# Altium project SKI_Induction.PrjPCB
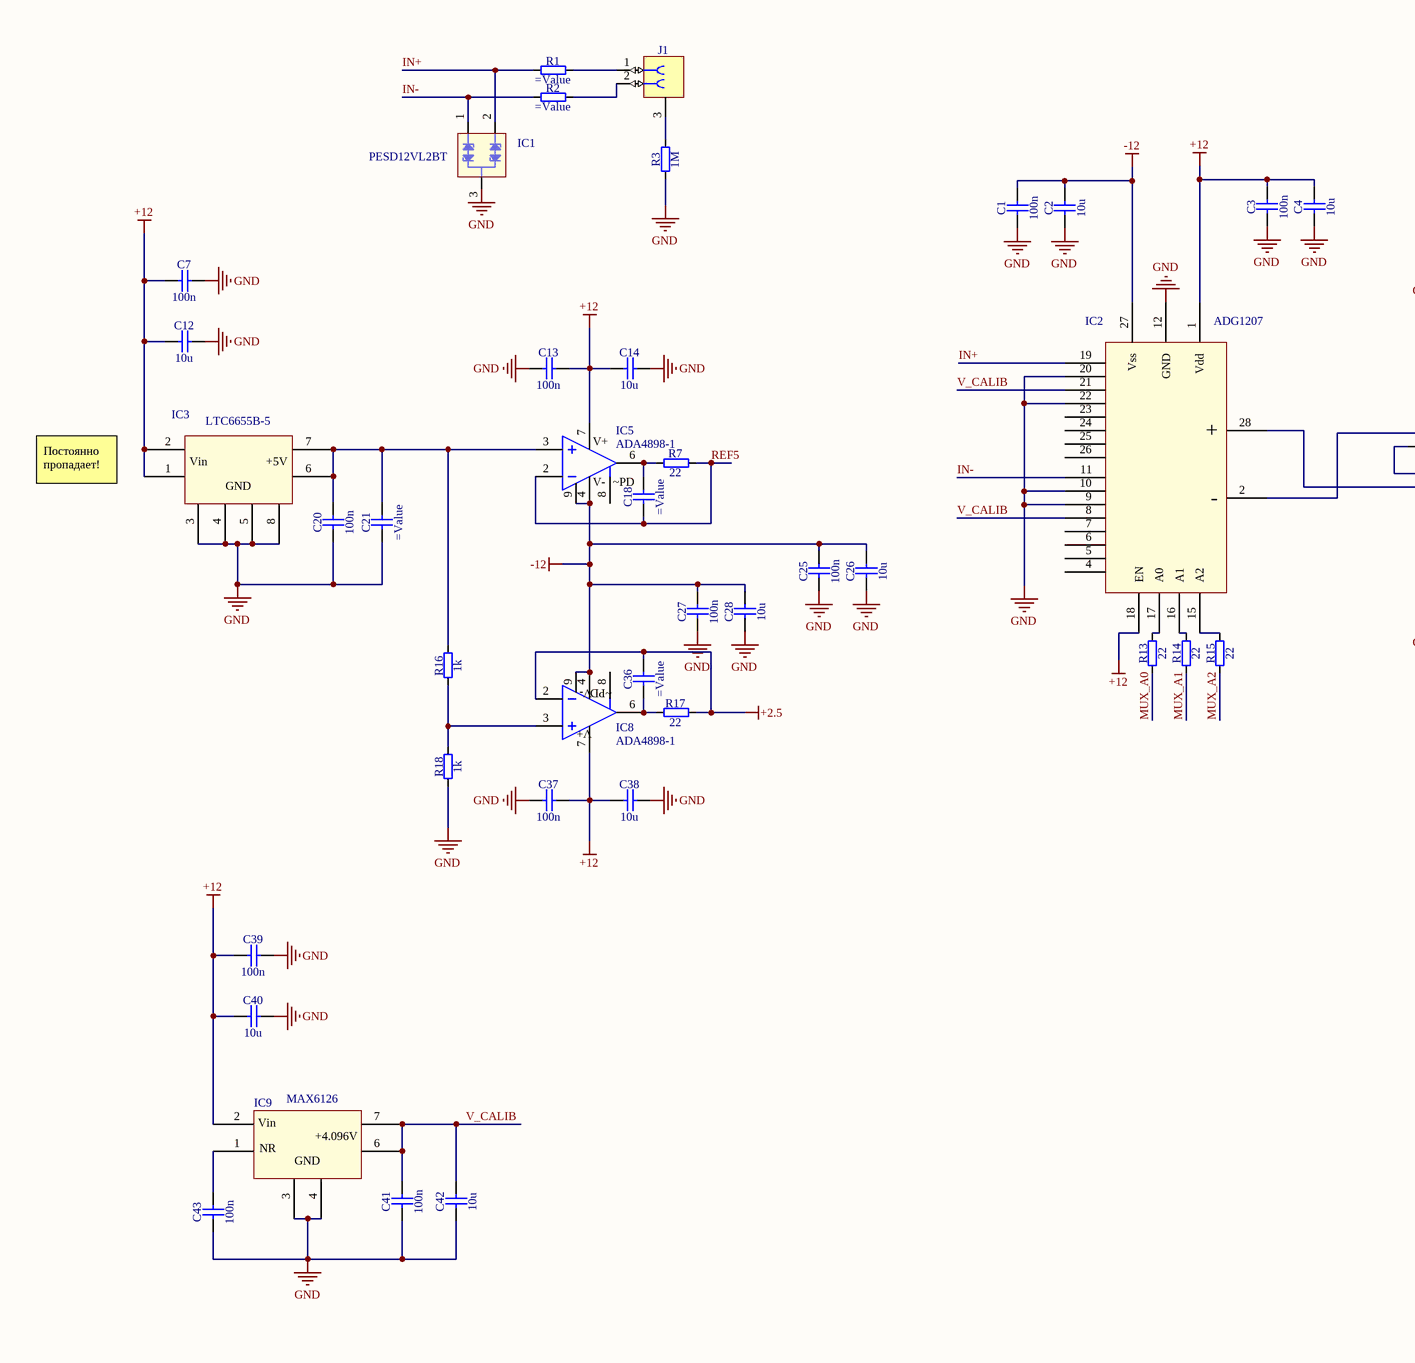
[diagram p0: Inductive_measurement.SchDoc, left]
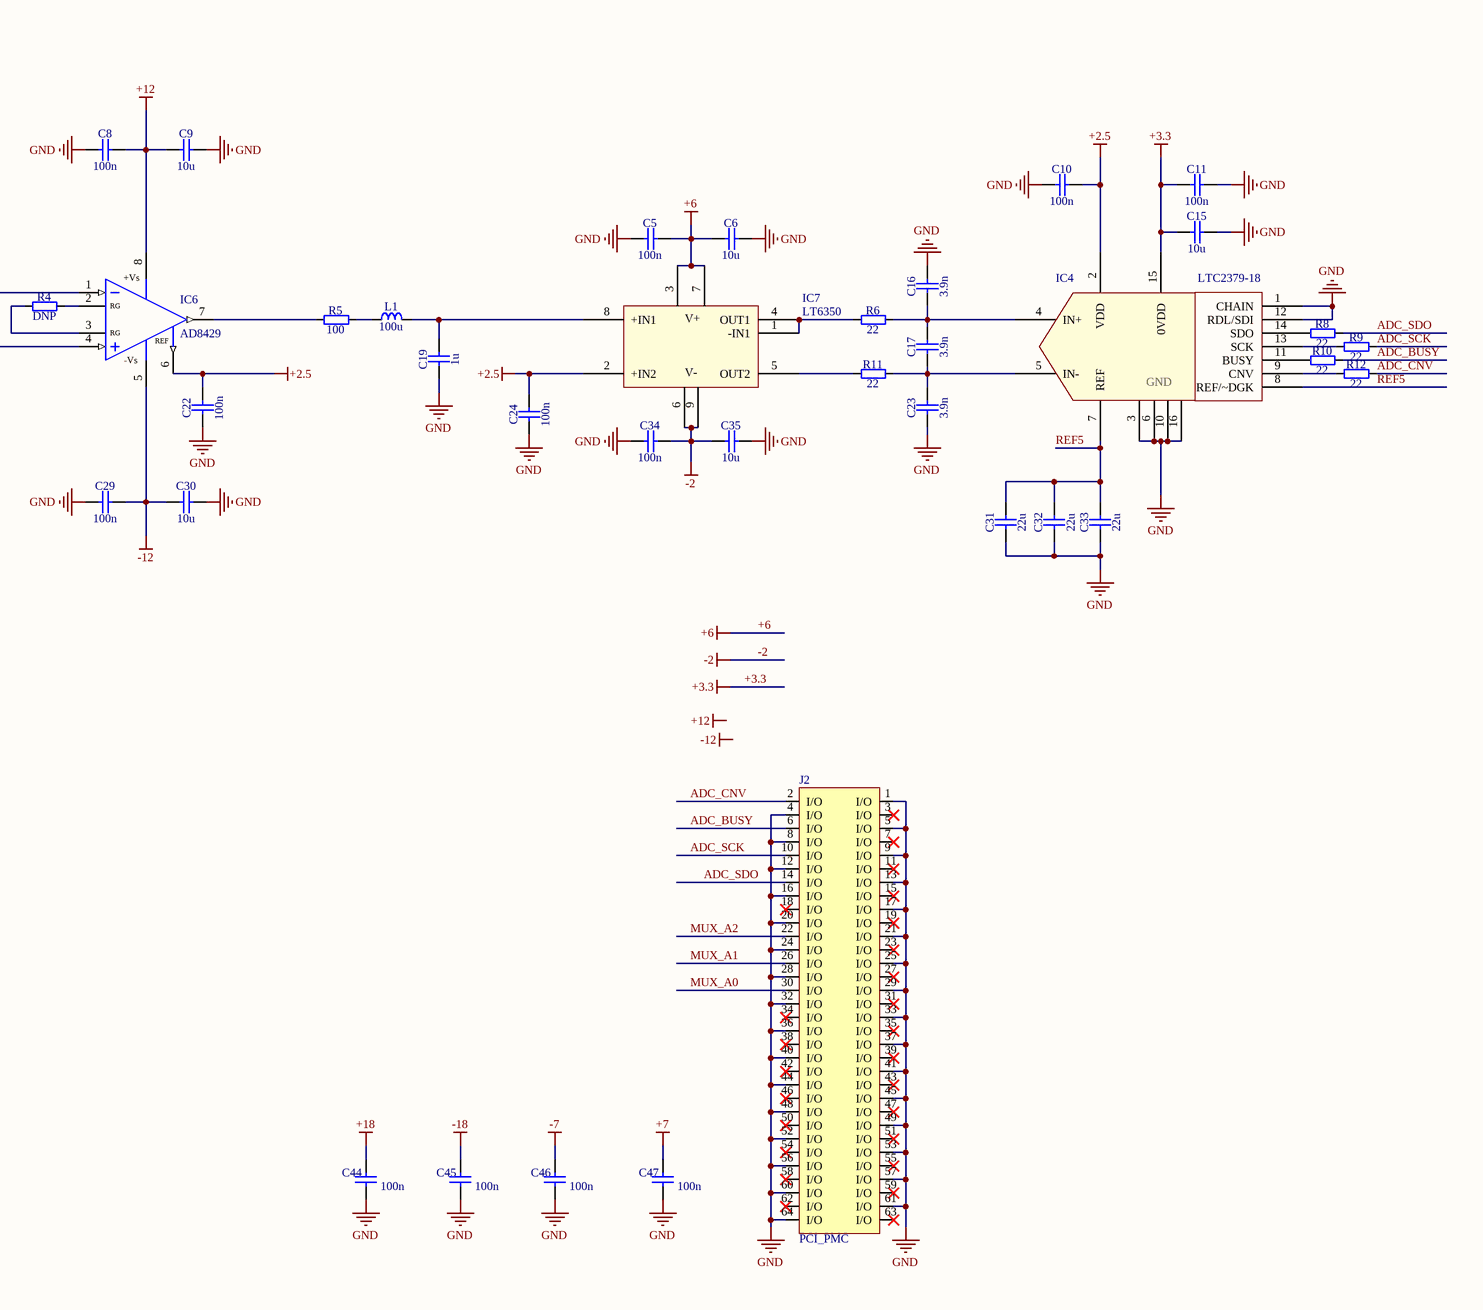
[diagram p1: Inductive_measurement.SchDoc, right]
2 sheets, 140 parts. Net scope: global (net labels, ports and power ports of the same name join across sheets).
Board file: Inductive_measurement.PcbDoc
Sheets:
  Inductive_measurement.SchDoc
  Int_LDOs.SchDoc

## Sheet Inductive_measurement.SchDoc
size A2

### Parts
C1  100n  [0603]
C2  10u  [0603]
C3  100n  [0603]
C4  10u  [0603]
C5  100n  [0603]
C6  10u  [0603]
C7  100n  [0603]
C8  100n  [0603]
C9  10u  [0603]
C10  100n  [0603]
C11  100n  [0603]
C12  10u  [0603]
C13  100n  [0603]
C14  10u  [0603]
C15  10u  [0603]
C16  3.9n  [0805]
C17  3.9n  [0805]
C18  (no value)  [0603]
C19  1u  [CAPR500-450X730X950]
C20  100n  [0603]
C21  (no value)  [0603]
C22  100n  [0603]
C23  3.9n  [0805]
C24  100n  [0603]
C25  100n  [0603]
C26  10u  [0603]
C27  100n  [0603]
C28  10u  [0603]
C29  100n  [0603]
C30  10u  [0603]
C31  22u  [0603]
C32  22u  [0603]
C33  22u  [0603]
C34  100n  [0603]
C35  10u  [0603]
C36  (no value)  [0603]
C37  100n  [0603]
C38  10u  [0603]
C39  100n  [0603]
C40  10u  [0603]
C41  100n  [0603]
C42  10u  [0603]
C43  100n  [0603]
C44  100n  [0603]
C45  100n  [0603]
C46  100n  [0603]
C47  100n  [0603]
IC1  PESD12VL2BT  [SOT95P280X115-3N]
IC2  ADG1207  [SOP65P640X120-28N]
IC3  LTC6655B-5  [SOP65P488X110-8N]
IC4  LTC2379-18  [SOP50P490X110-16N]
IC5  ADA4898-1  [SOIC127P600X175-9N-S229]
IC6  AD8429  [SOIC127P600X175-8N]
IC7  LT6350  [SON50P300X300X80-9N-R175X248]
IC8  ADA4898-1  [SOIC127P600X175-9N-S229]
IC9  MAX6126  [SOIC127P600X175-8N]
J1  (no value)  [LEMO_EPG.0B.302.HLN]
J2  PCI_PMC  [TYCO_120527-1]
L1  100u  [INDAD1524-920X400]
R1  (no value)  [0603]
R2  (no value)  [0603]
R3  1M  [0603]
R4  DNP  [0805]
R5  100  [0805]
R6  22  [0805]
R7  22  [0603]
R8  22  [0603]
R9  22  [0603]
R10  22  [0603]
R11  22  [0805]
R12  22  [0603]
R13  22  [0603]
R14  22  [0603]
R15  22  [0603]
R16  1k  [0805]
R17  22  [0603]
R18  1k  [0805]

### Nets
+2.5: C10.2 C22.2 C24.2 C36.2 IC4.2(VDD) IC6.6(REF) IC7.2(+IN2) IC8.2(IN-) R17.2
+3.3: C11.1 C15.1 IC4.15(0VDD)
+6: C5.2 C6.1 IC7.3(V+) IC7.7
+7: C47.2
+12: C3.2 C4.2 C7.1 C8.2 C9.1 C12.1 C13.2 C14.1 C37.1 C38.2 C39.1 C40.1 IC2.1(Vdd) IC2.18(EN) IC3.1 IC3.2 IC5.7(V+) IC6.8(+Vs) IC8.7(V+) IC9.2
+18: C44.2
-2: C34.2 C35.1 IC7.6(V-) IC7.9(V-)
-7: C46.2
-12: C1.2 C2.2 C25.2 C26.2 C27.2 C28.2 C29.2 C30.1 IC2.27(Vss) IC5.4(V-) IC5.9(EXPOSED_PAD) IC6.5(-Vs) IC8.4(V-) IC8.9(EXPOSED_PAD)
-18: C45.2
GND: C1.1 C2.1 C3.1 C4.1 C5.1 C6.2 C7.2 C8.1 C9.2 C10.1 C11.2 C12.2 C13.1 C14.2 C15.2 C16.2 C19.1 C20.1 C21.1 C22.1 C23.1 C24.1 C25.1 C26.1 C27.1 C28.1 C29.1 C30.2 C31.1 C32.1 C33.1 C34.1 C35.2 C37.2 C38.1 C39.2 C40.2 C41.1 C42.1 C43.1 C44.1 C45.1 C46.1 C47.1 IC1.3(double_cathode) IC2.9 IC2.10 IC2.12(GND) IC2.20 IC2.22 IC3.3 IC3.4 IC3.5 IC3.8 IC4.1(CHAIN) IC4.3 IC4.6 IC4.10 IC4.12(RDL/SDI) IC4.16 IC9.3 IC9.4 J2.1(I/O) J2.4(I/O) J2.5(I/O) J2.8(I/O) J2.9(I/O) J2.12(I/O) J2.13(I/O) J2.16(I/O) J2.17(I/O) J2.20(I/O) J2.21(I/O) J2.24(I/O) J2.25(I/O) J2.28(I/O) J2.29(I/O) J2.32(I/O) J2.33(I/O) J2.36(I/O) J2.37(I/O) J2.40(I/O) J2.41(I/O) J2.44(I/O) J2.45(I/O) J2.48(I/O) J2.49(I/O) J2.52(I/O) J2.53(I/O) J2.56(I/O) J2.57(I/O) J2.60(I/O) J2.61(I/O) J2.64(I/O) R3.1 R18.1
ADC_BUSY: J2.6(I/O) R10.2
ADC_CNV: J2.2(I/O) R12.2
ADC_SCK: J2.10(I/O) R9.2
ADC_SDO: J2.14(I/O) R8.2
IN+: IC1.2(C2) IC2.19 R1.1
IN-: IC1.1(C1) IC2.11 R2.1
MUX_A0: J2.30(I/O) R13.1
MUX_A1: J2.26(I/O) R14.1
MUX_A2: J2.22(I/O) R15.1
REF5: C18.1 C31.2 C32.2 C33.2 IC4.7(REF) IC4.8(REF/~DGK) IC5.2(IN-) R7.2
V_CALIB: C41.2 C42.2 IC2.8 IC2.21 IC9.6 IC9.7
NetC16_1: C16.1 C17.2 IC4.4(IN+) R6.2
NetC17_1: C17.1 C23.2 IC4.5(IN-) R11.2
NetC18_2: C18.2 IC5.6(OUT) R7.1
NetC19_2: C19.2 IC7.8(+IN1) L1.2
NetC20_2: C20.2 C21.2 IC3.6 IC3.7 IC5.3(IN+) R16.2
NetC36_1: C36.1 IC8.6(OUT) R17.1
NetC43_2: C43.2 IC9.1
NetIC2_2: IC2.2(-) IC6.1(-IN)
NetIC2_15: IC2.15(A2) R15.2
NetIC2_16: IC2.16(A1) R14.2
NetIC2_17: IC2.17(A0) R13.2
NetIC2_28: IC2.28(+) IC6.4(+IN)
NetIC4_9: IC4.9(CNV) R12.1
NetIC4_11: IC4.11(BUSY) R10.1
NetIC4_13: IC4.13(SCK) R9.1
NetIC4_14: IC4.14(SDO) R8.1
NetIC6_2: IC6.2(RG) R4.2
NetIC6_3: IC6.3(RG) R4.1
NetIC6_7: IC6.7(Vout) R5.1
NetIC7_1: IC7.1(-IN1) IC7.4(OUT1) R6.1
NetIC7_5: IC7.5(OUT2) R11.1
NetIC8_3: IC8.3(IN+) R16.1 R18.2
NetJ1_1: J1.1 R1.2
NetJ1_2: J1.2 R2.2
NetJ1_3: J1.3 R3.2
NetL1_1: L1.1 R5.2

Not connected (* = marked no-connect by the designer): IC2 4 5 6 7 23 24 25 26; IC5 8(~PD); IC8 8(~PD); J2 3(I/O)* 7(I/O)* 11(I/O)* 15(I/O)* 18(I/O)* 19(I/O)* 23(I/O)* 27(I/O)* 31(I/O)* 34(I/O)* 35(I/O)* 38(I/O)* 39(I/O)* 42(I/O)* 43(I/O)* 46(I/O)* 47(I/O)* 50(I/O)* 51(I/O)* 54(I/O)* 55(I/O)* 58(I/O)* 59(I/O)* 62(I/O)* 63(I/O)*

### Notes on the sheet
- Постоянно пропадает!
- Labels drawn without touching a wire or pin: +12, -12
- (in symbol LTC2379-18) GND
- (in symbol LTC6655B-5) Vin; +5V; GND
- (in symbol MAX6126AASA41) Vin; +4.096V; NR; GND

### Library data of the parts
C1-C18 C20-C47 = Capacitor
C19 = Capacitor 4.5mm x 7.3mm
IC2 = ADG1207: 8-channel multiplexer
IC3 = LTC6655B-5: Reference, 5 V
IC4 = LTC2379-18: ADC
IC5 IC8 = ADA4898-1: Op amp
IC6 = AD8429: 1 nV/sqrt Hz Low Noise Instrumentation Amplifier
IC7 = LT6350: ADC driver
IC9 = MAX6126AASA41: Reference, 4.096 V
J1 = Connector 2 Female
J2 = PCI_PMC: PCI Mezzanine Connector; IEEE 1386 Mezzanine board; Manufactuer: TE Connectivity; PartField: 120527-1; SolderOption: 2; Pkg: PMC Male (IEEE 1386); Value: PCI_PMC; Vendor: TE Connectivity
L1 = Inductor
R1-R18 = Resistor

## Sheet Int_LDOs.SchDoc
size 420 x 297 mm; Address1: Address1; Address2: Address2; Address3: Address3; Address4: Address4; SheetNumber: 1; Scale: 1:1; Разраб.: Иванов; Обозначение документа: АБВГ.123456.001 Э3; Пров.: Петров; Утв.: Сидоров; Наименование организации: ОАО "Концерн "МПО-Гидроприбор"; Перв. применение: АБВГ.123456.000; Наименование изделия 1: Плата; Наименование изделия 2: Схема электрическая; Наименование изделия 3: принципиальная; Нач. отд.: Нач. отд.; Фамилия нач. отд.: Сидоров
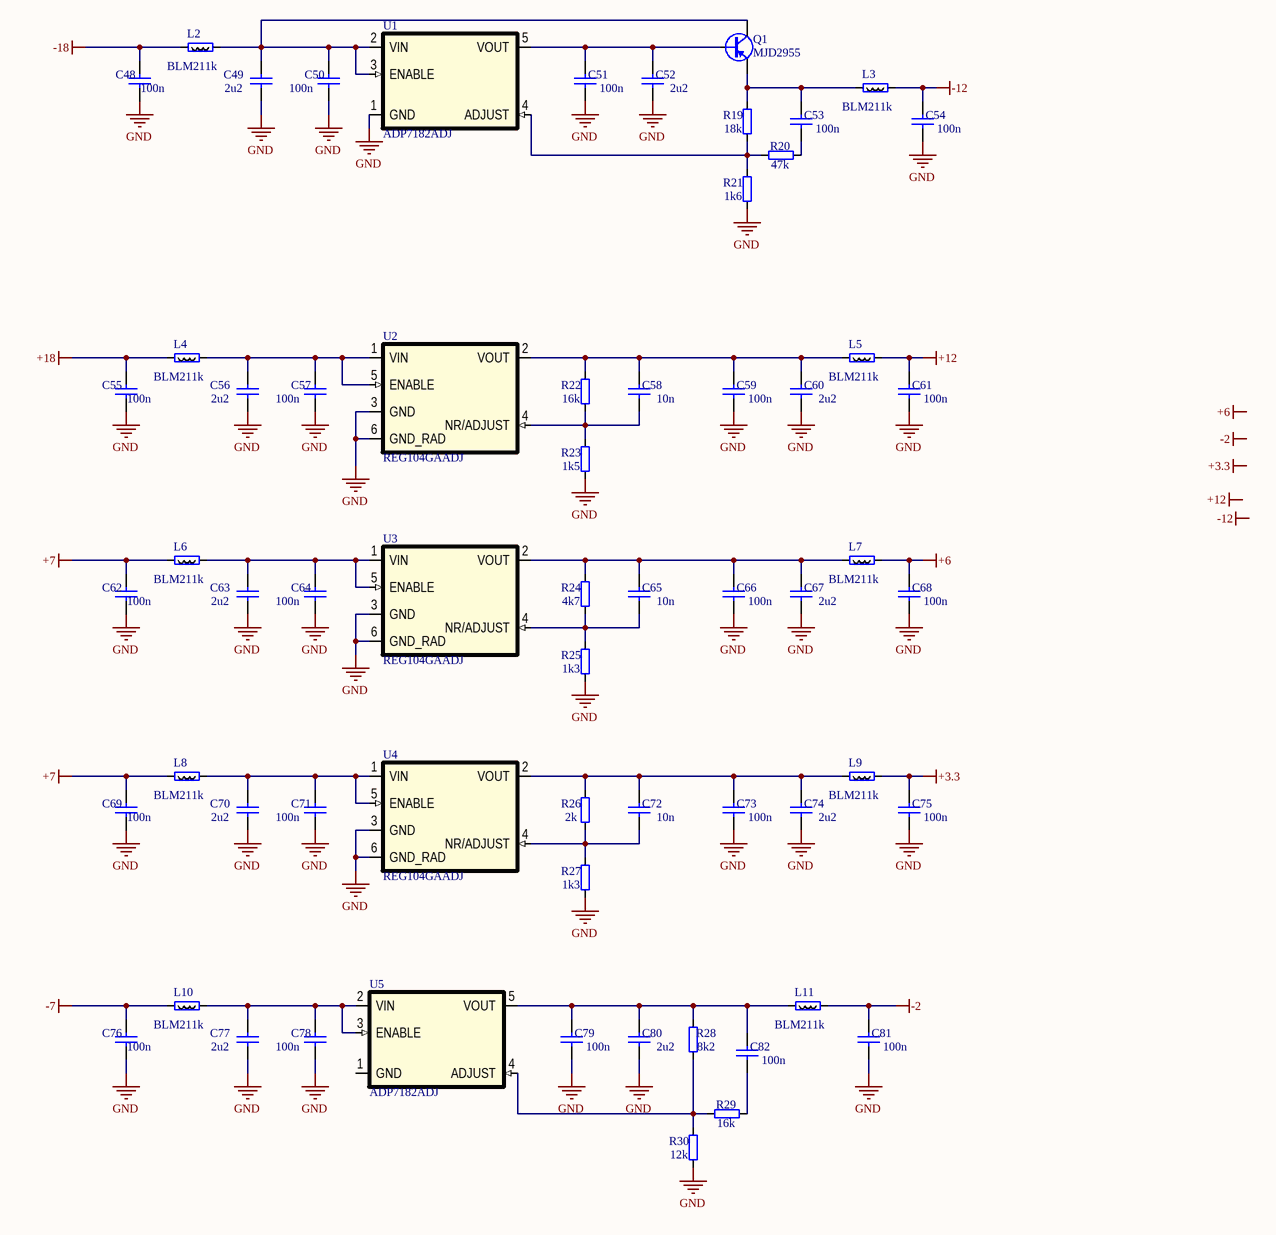
[diagram p2: Int_LDOs.SchDoc]

### Parts
C48  100n  [0603]
C49  2u2  [0805]
C50  100n  [0603]
C51  100n  [0603]
C52  2u2  [0805]
C53  100n  [0603]
C54  100n  [0603]
C55  100n  [0603]
C56  2u2  [0805]
C57  100n  [0603]
C58  10n  [0603]
C59  100n  [0603]
C60  2u2  [0805]
C61  100n  [0603]
C62  100n  [0603]
C63  2u2  [0805]
C64  100n  [0603]
C65  10n  [0603]
C66  100n  [0603]
C67  2u2  [0805]
C68  100n  [0603]
C69  100n  [0603]
C70  2u2  [0805]
C71  100n  [0603]
C72  10n  [0603]
C73  100n  [0603]
C74  2u2  [0805]
C75  100n  [0603]
C76  100n  [0603]
C77  2u2  [0805]
C78  100n  [0603]
C79  100n  [0603]
C80  2u2  [0805]
C81  100n  [0603]
C82  100n  [0603]
L2  BLM211k  [0805]
L3  BLM211k  [0805]
L4  BLM211k  [0805]
L5  BLM211k  [0805]
L6  BLM211k  [0805]
L7  BLM211k  [0805]
L8  BLM211k  [0805]
L9  BLM211k  [0805]
L10  BLM211k  [0805]
L11  BLM211k  [0805]
Q1  MJD2955  [DPAK]
R19  18k  [0603]
R20  47k  [0603]
R21  1k6  [0603]
R22  16k  [0603]
R23  1k5  [0603]
R24  4k7  [0603]
R25  1k3  [0603]
R26  2k  [0603]
R27  1k3  [0603]
R28  8k2  [0603]
R29  16k  [0603]
R30  12k  [0603]
U1  ADP7182ADJ  [SOT23-5]
U2  REG104GAADJ  [SOT223_6-127]
U3  REG104GAADJ  [SOT223_6-127]
U4  REG104GAADJ  [SOT223_6-127]
U5  ADP7182ADJ  [SOT23-5]

### Nets
+3.3: C75.2 L9.2
+6: C68.2 L7.2
+7: C62.2 C69.2 L6.1 L8.1
+12: C61.2 L5.2
+18: C55.2 L4.1
-2: C81.2 L11.2
-7: C76.2 L10.1
-12: C54.2 L3.2
-18: C48.2 L2.1
GND: C48.1 C49.1 C50.1 C51.1 C52.1 C54.1 C55.1 C56.1 C57.1 C59.1 C60.1 C61.1 C62.1 C63.1 C64.1 C66.1 C67.1 C68.1 C69.1 C70.1 C71.1 C73.1 C74.1 C75.1 C76.1 C77.1 C78.1 C79.1 C80.1 C81.1 R21.1 R23.1 R25.1 R27.1 R30.1 U1.1(GND) U2.3(GND) U2.6(GND_RAD) U3.3(GND) U3.6(GND_RAD) U4.3(GND) U4.6(GND_RAD)
NetC49_2: C49.2 C50.2 L2.2 Q1.3(C) U1.2(VIN) U1.3(ENABLE)
NetC51_2: C51.2 C52.2 Q1.1(B) U1.5(VOUT)
NetC53_1: C53.1 R20.2
NetC53_2: C53.2 L3.1 Q1.2(E) R19.2
NetC56_2: C56.2 C57.2 L4.2 U2.1(VIN) U2.5(ENABLE)
NetC58_1: C58.1 R22.1 R23.2 U2.4(NR/ADJUST)
NetC58_2: C58.2 C59.2 C60.2 L5.1 R22.2 U2.2(VOUT)
NetC63_2: C63.2 C64.2 L6.2 U3.1(VIN) U3.5(ENABLE)
NetC65_1: C65.1 R24.1 R25.2 U3.4(NR/ADJUST)
NetC65_2: C65.2 C66.2 C67.2 L7.1 R24.2 U3.2(VOUT)
NetC70_2: C70.2 C71.2 L8.2 U4.1(VIN) U4.5(ENABLE)
NetC72_1: C72.1 R26.1 R27.2 U4.4(NR/ADJUST)
NetC72_2: C72.2 C73.2 C74.2 L9.1 R26.2 U4.2(VOUT)
NetC77_2: C77.2 C78.2 L10.2 U5.2(VIN) U5.3(ENABLE)
NetC79_2: C79.2 C80.2 C82.2 L11.1 R28.2 U5.5(VOUT)
NetC82_1: C82.1 R29.2
NetR19_1: R19.1 R20.1 R21.2 U1.4(ADJUST)
NetR28_1: R28.1 R29.1 R30.2 U5.4(ADJUST)

Not connected (* = marked no-connect by the designer): U5 1(GND)

### Notes on the sheet
- Labels drawn without touching a wire or pin: +3.3, +6, +12, -2, -12
- Подп. и дата
- Инв. № дубл.
- Взам. инв. №
- Инв. № подл.
- Изм.
- Лист
- № докум.
- Подп.
- Дата
- Копировал
- Формат А3

### Library data of the parts
C48-C82 = Capacitor
L2-L11 = BLM21: SMD Ferrite bead 0805; Vendor: Vishay; Value: 1k; Pkg: SMD0805; SMD Solders: 2; Solder Option: RM; Price: 10; Device: BLM21
Q1 = MJD2955: PNP транзистор; Vendor: ON Semiconductor; SMD Solders: 3; Solder Option: RM; Name to order: MJD29G55; Voltage: -60V; Pkg: DPAK; Price: 100; Device: MJD2955
R19-R30 = Resistor
U1 U5 = ADP7182: Negative LDO Linear stabilizer; Vendor: Analog Devoces; Value: ADJ; SMD Solders: 5; Solder Option: RM; Name to order: ADP7182AUJZ-R7; Vref: 1V22; Pkg: SOT23-5; Price: 100; Device: ADP7182
U2-U4 = REG104GA: Positive LDO Linear stabilizer; Vendor: Texas Instruments; Value: ADJ; SMD Solders: 6; Solder Option: RM; TC: 70ppm/C; Tolerance: +-2% Max; Pkg: SOT223-6; Name to order: REG104GA-A; Vref: 1V295; Price: 1000; Device: REG104GA

## Nets that join several sheets
+3.3: Inductive_measurement (C11.1 C15.1 IC4.15), Int_LDOs (C75.2 L9.2)
+6: Inductive_measurement (C5.2 C6.1 IC7.3 IC7.7), Int_LDOs (C68.2 L7.2)
+7: Inductive_measurement (C47.2), Int_LDOs (C62.2 C69.2 L6.1 L8.1)
+12: Inductive_measurement (20 pins), Int_LDOs (C61.2 L5.2)
+18: Inductive_measurement (C44.2), Int_LDOs (C55.2 L4.1)
-2: Inductive_measurement (C34.2 C35.1 IC7.6 IC7.9), Int_LDOs (C81.2 L11.2)
-7: Inductive_measurement (C46.2), Int_LDOs (C76.2 L10.1)
-12: Inductive_measurement (14 pins), Int_LDOs (C54.2 L3.2)
-18: Inductive_measurement (C45.2), Int_LDOs (C48.2 L2.1)
GND: Inductive_measurement (96 pins), Int_LDOs (42 pins)